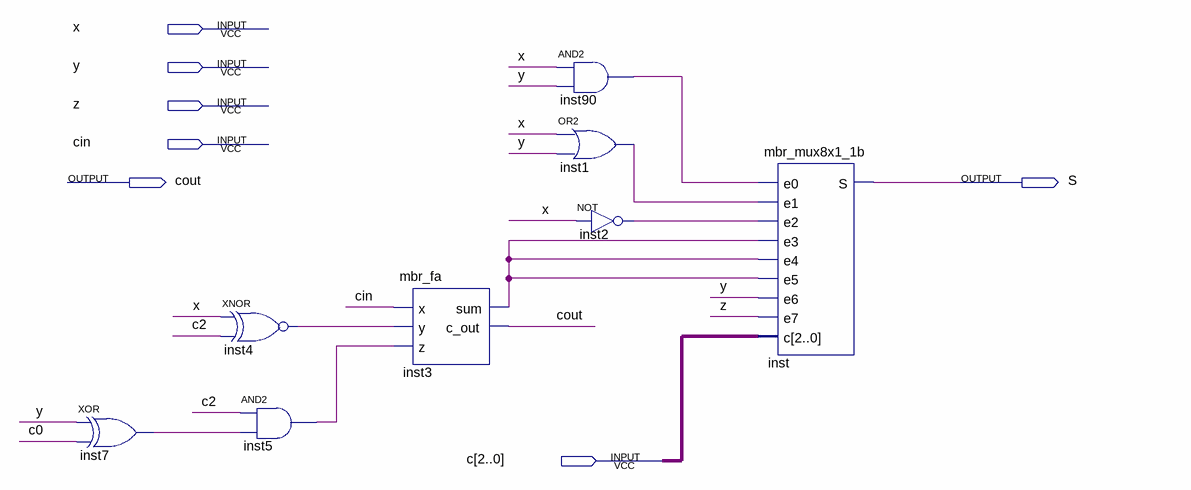
[diagram p0: schematic sheet]
// Quartus schematic bloco_unitario.bdf as structural Verilog: 8 symbols, 7 pins
module bloco_unitario (
  input  x,
  input  y,
  input  z,
  input  cin,
  input  [2:0] c,
  output cout,
  output S
);

  wire inst1_out, inst2_out, inst3_sum, inst4_out, inst5_out, inst7_out, inst90_out;

  xor inst7 (inst7_out, y, c[0]);
  xnor inst4 (inst4_out, x, c[2]);
  and inst5 (inst5_out, c[2], inst7_out);
  mbr_fa inst3 (.x(cin), .y(inst4_out), .z(inst5_out), .sum(inst3_sum), .c_out(cout));
  and inst90 (inst90_out, x, y);
  or inst1 (inst1_out, x, y);
  not inst2 (inst2_out, x);
  mbr_mux8x1_1b inst (
    .e0(inst90_out), .e1(inst1_out), .e2(inst2_out), .e3(inst3_sum), .e4(inst3_sum), .e5(inst3_sum), .e6(y),
    .e7(z), .c(c), .S(S));
endmodule
